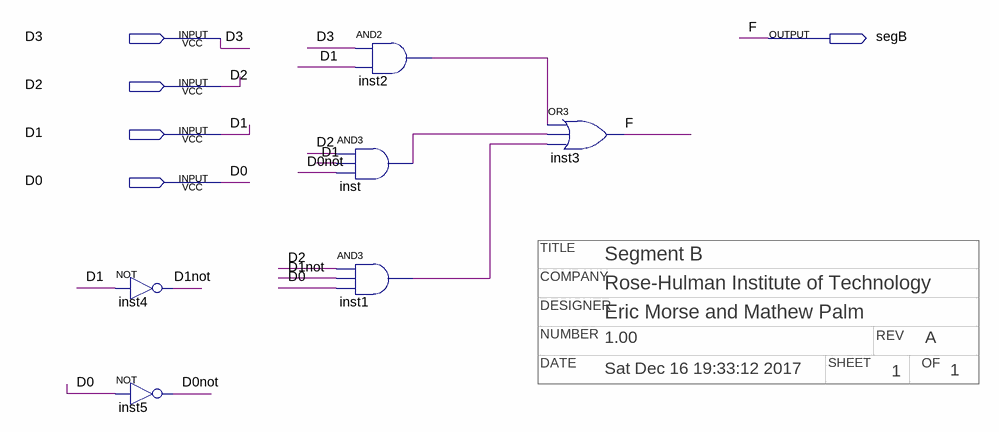
[diagram p0: schematic sheet]
// Quartus schematic segB.bdf as structural Verilog: 6 symbols, 5 pins
// Title block: COMPANY: Rose-Hulman Institute of Technology; DATE: Sat Dec 16 19:33:12 2017; DESIGNER: Eric Morse and Mathew Palm; NUMBER: 1.00; OF: 1; REV: A; SHEET: 1; TITLE: Segment B
module segB (
  input  D3,
  input  D2,
  input  D1,
  input  D0,
  output segB
);

  wire D0not, D1not, inst1_out, inst2_out, inst_out;

  not inst4 (D1not, D1);
  not inst5 (D0not, D0);
  and inst2 (inst2_out, D3, D1);
  and inst (inst_out, D2, D1, D0not);
  and inst1 (inst1_out, D2, D1not, D0);
  or inst3 (segB, inst2_out, inst_out, inst1_out);

  // Other names for the same wires on the sheet: F = segB
endmodule
